# Altium schematic sheet MCU.schdoc
size 311 x 208 mm
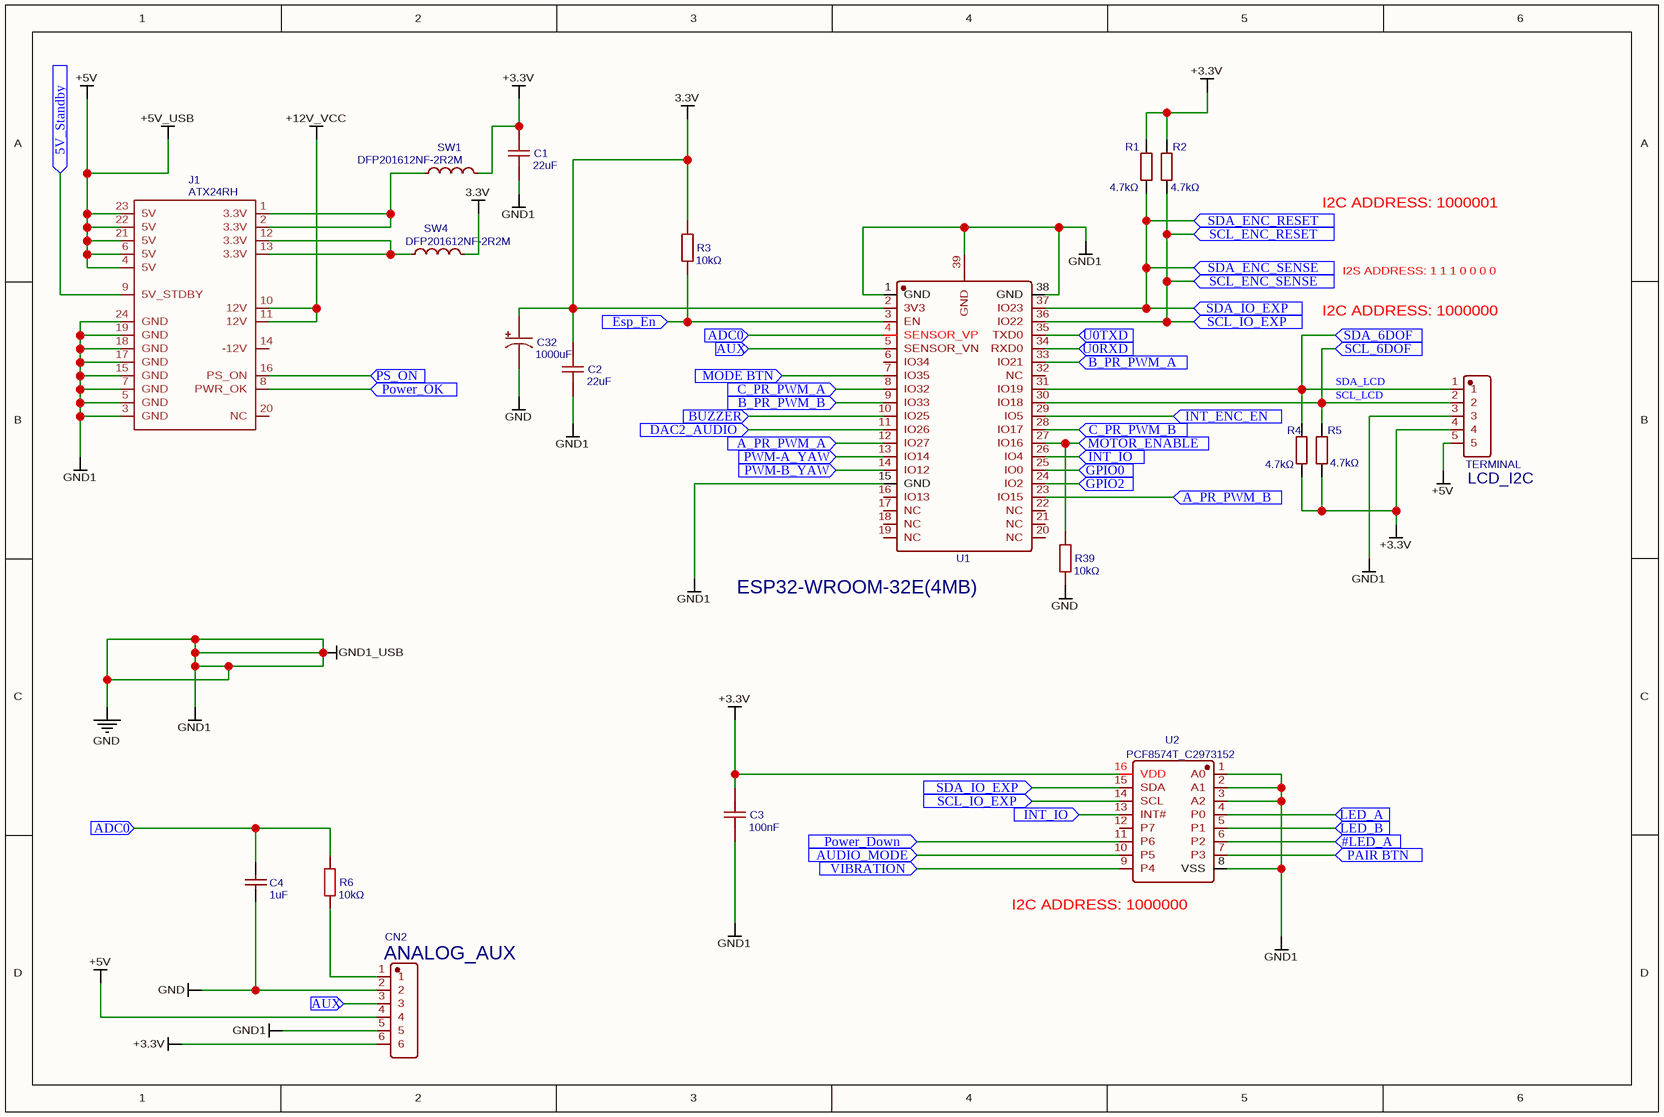
[diagram p0: MCU.schdoc]

## Parts
C1  22uF  [C0805]
C2  22uF  [C0805]
C3  100nF  [C0805]
C4  1uF  [C1206]
C32  1000uF  [CAP-SMD_BD8.0-L8.3-W8.3-LS9.1-FD]
CN2  ANALOG_AUX  [CONN-TH_HX39601-6WAD]
J1  ATX24RH  [ATX24_RIGHT_ANGLE]
R1  4.7kΩ  [R0805]
R2  4.7kΩ  [R0805]
R3  10kΩ  [R0805]
R4  4.7kΩ  [R0805]
R5  4.7kΩ  [R0805]
R6  10kΩ  [R0805]
R39  10kΩ  [R0805]
SW1  DFP201612NF-2R2M  [IND-SMD_L2.0-W1.6]
SW4  DFP201612NF-2R2M  [IND-SMD_L2.0-W1.6]
TERMINAL  LCD_I2C  [CONN-TH_B5B-XH-AM-LF-SN]
U1  ESP32-WROOM-32E(4MB)  [WIFI-SMD_ESP32-WROOM-32E]
U2  PCF8574T_C2973152  [SO-16_L10.3-W7.5-P1.27-LS10.3-BL]

## Ports
5V_Standby (in), #LED_A (in), A_PR_PWM_A (in), A_PR_PWM_B (in), ADC0 (in), AUDIO_MODE (in), AUX (in), B_PR_PWM_A (in), B_PR_PWM_B (in), BUZZER (in), C_PR_PWM_A (in), C_PR_PWM_B (in), DAC2_AUDIO (in), Esp_En (in), GPIO0 (in), GPIO2 (in), INT_ENC_EN (in), INT_IO (in), LED_A (in), LED_B (in), MODE BTN (in), MOTOR_ENABLE (in), PAIR BTN (in), Power_Down (in), Power_OK (in), PS_ON (in), PWM-A_YAW (in), PWM-B_YAW (in), SCL_6DOF (in), SCL_ENC_RESET (in), SCL_ENC_SENSE (in), SCL_IO_EXP (in), SDA_6DOF (in), SDA_ENC_RESET (in), SDA_ENC_SENSE (in), SDA_IO_EXP (in), U0RXD (in), U0TXD (in), VIBRATION (in)

## Nets
3.3V: C2.2 C32.1 R3.2 SW4.2 U1.2(3V3)
+3.3V: C1.2 C3.1 CN2.6 R1.2 R2.2 R4.1 R5.1 SW1.2 TERMINAL.4 U2.16(VDD)
+5V: CN2.4 J1.4(5V) J1.6(5V) J1.21(5V) J1.22(5V) J1.23(5V) TERMINAL.5  [also labelled +5V_USB]
+12V_VCC: J1.10(12V) J1.11(12V)
GND: C1.1 C2.1 C3.2 C4.2 C32.2 CN2.2 CN2.5 J1.3(GND) J1.5(GND) J1.7(GND) J1.15(GND) J1.17(GND) J1.18(GND) J1.19(GND) J1.24(GND) R39.1 TERMINAL.3 U1.1(GND) U1.15(GND) U1.38(GND) U1.39(GND) U2.1(A0) U2.2(A1) U2.3(A2) U2.8(VSS)  [also labelled GND1, GND1_USB]
5V_Standby: J1.9(5V_STDBY) ; port 5V_Standby
#LED_A: U2.6(P2) ; port #LED_A
A_PR_PWM_A: U1.12(IO27) ; port A_PR_PWM_A
A_PR_PWM_B: U1.23(IO15) ; port A_PR_PWM_B
ADC0: C4.1 R6.2 U1.4(SENSOR_VP) ; port ADC0
AUDIO_MODE: U2.10(P5) ; port AUDIO_MODE
AUX: CN2.3 U1.5(SENSOR_VN) ; port AUX
B_PR_PWM_A: U1.33(IO21) ; port B_PR_PWM_A
B_PR_PWM_B: U1.9(IO33) ; port B_PR_PWM_B
BUZZER: U1.10(IO25) ; port BUZZER
C_PR_PWM_A: U1.8(IO32) ; port C_PR_PWM_A
C_PR_PWM_B: U1.28(IO17) ; port C_PR_PWM_B
DAC2_AUDIO: U1.11(IO26) ; port DAC2_AUDIO
Esp_En: R3.1 U1.3(EN) ; port Esp_En
GPIO0: U1.25(IO0) ; port GPIO0
GPIO2: U1.24(IO2) ; port GPIO2
INT_ENC_EN: U1.29(IO5) ; port INT_ENC_EN
INT_IO: U1.26(IO4) U2.13(INT#) ; port INT_IO
LED_A: U2.4(P0) ; port LED_A
LED_B: U2.5(P1) ; port LED_B
MODE BTN: U1.7(IO35) ; port MODE BTN
MOTOR_ENABLE: R39.2 U1.27(IO16) ; port MOTOR_ENABLE
PAIR BTN: U2.7(P3) ; port PAIR BTN
Power_Down: U2.11(P6) ; port Power_Down
Power_OK: J1.8(PWR_OK) ; port Power_OK
PS_ON: J1.16(PS_ON) ; port PS_ON
PWM-A_YAW: U1.13(IO14) ; port PWM-A_YAW
PWM-B_YAW: U1.14(IO12) ; port PWM-B_YAW
SCL_ENC_RESET: R2.1 U1.36(IO22) U2.14(SCL) ; port SCL_ENC_RESET, port SCL_IO_EXP, port SCL_ENC_SENSE
SCL_LCD: R5.2 TERMINAL.2 U1.30(IO18) ; port SCL_6DOF
SDA_ENC_RESET: R1.1 U1.37(IO23) U2.15(SDA) ; port SDA_ENC_RESET, port SDA_IO_EXP, port SDA_ENC_SENSE
SDA_LCD: R4.2 TERMINAL.1 U1.31(IO19) ; port SDA_6DOF
U0RXD: U1.34(RXD0) ; port U0RXD
U0TXD: U1.35(TXD0) ; port U0TXD
VIBRATION: U2.9(P4) ; port VIBRATION
NetCN2_1: CN2.1 R6.1
NetJ1_1: J1.1(3.3V) J1.2(3.3V) SW1.1
NetJ1_12: J1.12(3.3V) J1.13(3.3V) SW4.1

Not connected (* = marked no-connect by the designer): J1 14(-12V) 20(NC); U1 6(IO34) 16(IO13) 17(NC) 18(NC) 19(NC) 20(NC) 21(NC) 22(NC) 32(NC); U2 12(P7)

## Notes on the sheet
- I2C ADDRESS: 1000001
- I2C ADDRESS: 1000000
- I2S ADDRESS: 1 1 1 0 0 0 0
- (near U2) I2C ADDRESS: 1000000

## Library data of the parts
C1 C2 = 22uF: BOM_Manufacturer: SAMSUNG; BOM_Manufacturer Part: CL21A226KQQNNNE; nameAlias: Capacitance; BOM_Supplier: LCSC; BOM_Supplier Part: C87997; BOM_JLCPCB Part Class: Extended Part; spicePre: C; spiceSymbolName: CL21A226KQQNNNE
C3 = 100nF: BOM_Manufacturer: YAGEO; BOM_Manufacturer Part: CC0805KRX7R8BB104; nameAlias: Capacitance; Contributor: LCSC; BOM_Supplier: LCSC; BOM_Supplier Part: C519981; BOM_JLCPCB Part Class: Extended Part; spicePre: C; spiceSymbolName: CC0805KRX7R8BB104
C4 = 1uF: BOM_Manufacturer: YAGEO; BOM_Manufacturer Part: CC1206KKX7R8BB105; nameAlias: Capacitance; BOM_Supplier: LCSC; BOM_Supplier Part: C107184; BOM_JLCPCB Part Class: Extended Part; spicePre: C; spiceSymbolName: CC1206KKX7R8BB105
C32 = 1000uF: BOM_Manufacturer: ROQANG; BOM_Manufacturer Part: RT1A102M0810; nameAlias: Capacitance; Contributor: LCSC; BOM_Supplier: LCSC; BOM_Supplier Part: C280406; BOM_JLCPCB Part Class: Extended Part; spicePre: C; spiceSymbolName: RT1A102M0810
CN2 = ANALOG_AUX: BOM_Manufacturer: HX(红星); BOM_Manufacturer Part: HX39601-6WAD; Contributor: LCSC; BOM_Supplier: LCSC; BOM_Supplier Part: C703276; BOM_JLCPCB Part Class: Extended Part; spicePre: C; spiceSymbolName: HX39601-6WAD
J1 = ATX24RH: BOM_Manufacturer Part: M4202V-2x12P; BOM_Manufacturer: XFCN(兴飞); description: ATX24 Pin Power Supply Connector This is a good connector for connecting a computer power supply to a PCB. Its massive, but provides many amps of power at 5V and 12V. SKU: PRT-09498; Contributor: SparkFun; spicePre: J; spiceSymbolName: ATX24RH; BOM_Supplier: LCSC; BOM_Supplier Part: C492535
R1 R2 R4 R5 = 4.7kΩ: BOM_Manufacturer: UniOhm; BOM_Manufacturer Part: 0805W8J0472T5E; nameAlias: Resistance; Resistance (Ohms): 4.7K; BOM_Supplier: LCSC; BOM_Supplier Part: C26022; BOM_JLCPCB Part Class: Extended Part; spicePre: R; spiceSymbolName: 0805W8J0472T5E
R3 R6 R39 = 10kΩ: BOM_Manufacturer: Ever Ohms Tech; BOM_Manufacturer Part: TR0805D10KP0550; Resistance (Ohms): 10K; nameAlias: Resistance; Contributor: LCSC; BOM_Supplier: LCSC; BOM_Supplier Part: C332266; BOM_JLCPCB Part Class: Extended Part; spicePre: R; spiceSymbolName: TR0805D10KP0550
SW1 SW4 = DFP201612NF-2R2M: BOM_Manufacturer: 台庆; Inductance: 2.2uH; Contributor: LCSC; BOM_Supplier: LCSC; BOM_Supplier Part: C2880050; BOM_Manufacturer Part: DFP201612NF-2R2M; spicePre: S; spiceSymbolName: DFP201612NF-2R2M
TERMINAL = LCD_I2C: BOM_Manufacturer: JST Sales America; BOM_Manufacturer Part: B5B-XH-A-M(LF)(SN); Contributor: LCSC; BOM_Supplier: LCSC; BOM_Supplier Part: C495550; BOM_JLCPCB Part Class: Extended Part; spicePre: C; spiceSymbolName: B5B-XH-A-M(LF)(SN)
U1 = ESP32-WROOM-32E(4MB): BOM_Manufacturer: Espressif Systems; Contributor: LCSC; BOM_Supplier: LCSC; BOM_Supplier Part: C701341; BOM_Manufacturer Part: ESP32-WROOM-32E(4MB); BOM_JLCPCB Part Class: Extended Part; spicePre: U; spiceSymbolName: ESP32-WROOM-32E(4MB)
U2 = PCF8574T_C2973152: BOM_Manufacturer: NXP Semicon; BOM_Manufacturer Part: PCF8574T/3,518; Contributor: LCSC; BOM_Supplier: LCSC; BOM_Supplier Part: C7605; link: https://atta.szlcsc.com//upload/public/pdf/source/20190611/C398075_1925312D8618E19C6137781D5B71A3CA.pdf; BOM_JLCPCB Part Class: Extended Part; spicePre: U; spiceSymbolName: PCF8574T_C2973152